# Altium schematic sheet Memory.SchDoc
size A; SheetNumber: 5; SheetTotal: 7
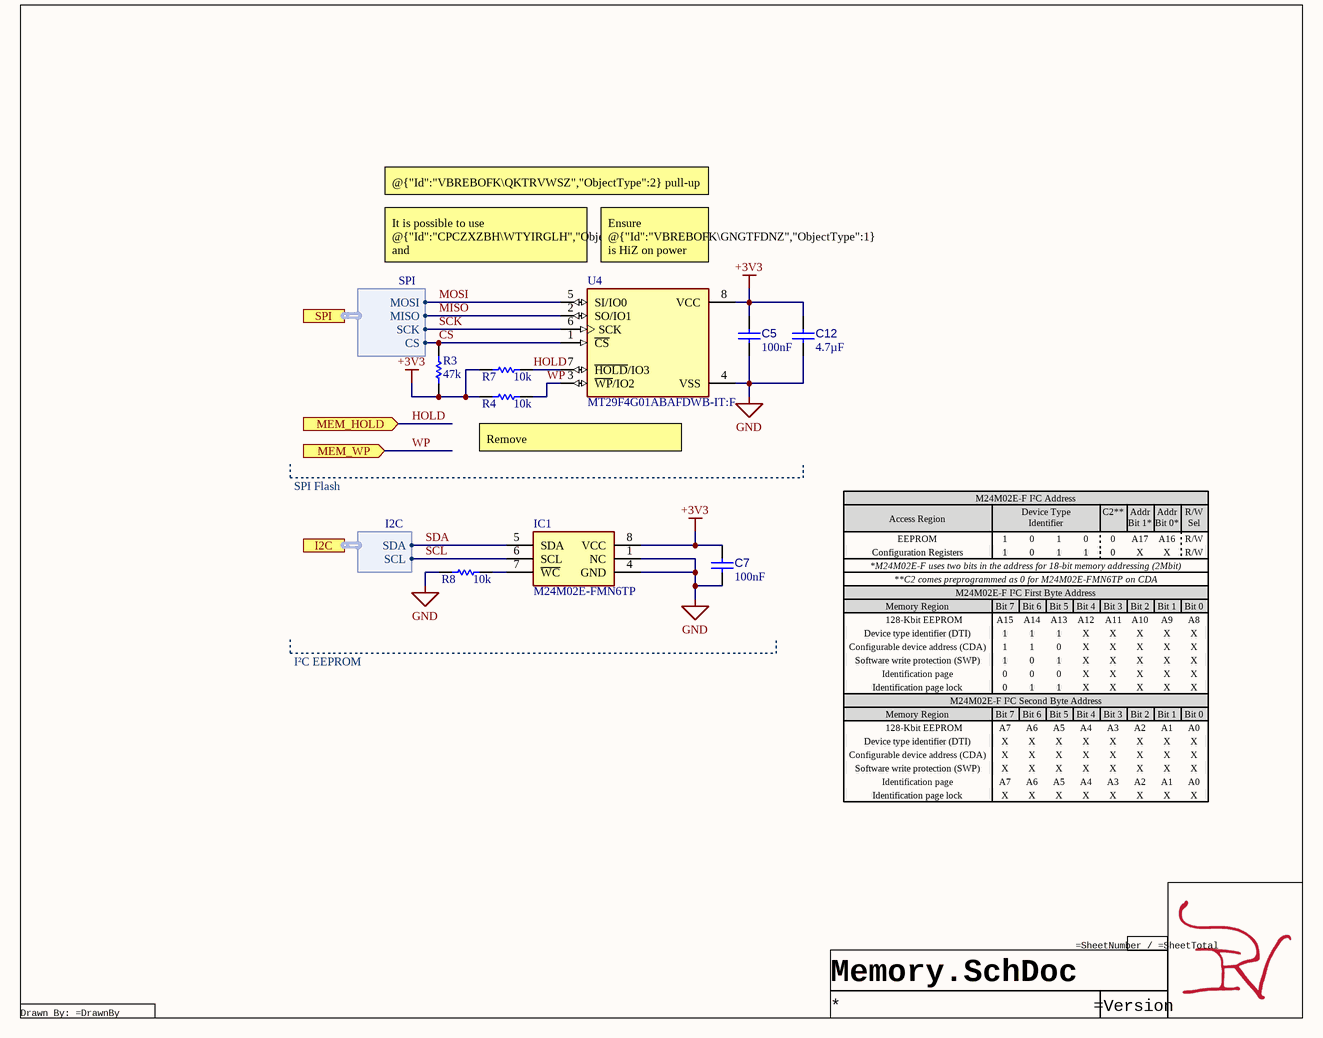
[diagram p0: Memory.SchDoc]

## Parts
C5  value 100nF  [CAP 0402_1005]  (hidden comment: CAP-NP-2)
C7  value 100nF  [CAP 0402_1005]  (hidden comment: CAP-NP-2)
C12  value 4.7µF  [CAP 0402_1005]  (hidden comment: CL05A475MP5NRNC)
IC1  M24M02E-FMN6TP  [SOIC127P600X175-8N]
R3  value 47k  [RES 0402_1005]  (hidden comment: 47k-0402-0.1/1)
R4  value 10k  [RES 0402_1005]  (hidden comment: 10K-0402-0.1/1)
R7  value 10k  [RES 0402_1005]  (hidden comment: 10K-0402-0.1/1)
R8  value 10k  [RES 0402_1005]  (hidden comment: 10K-0402-0.1/1)
U4  MT29F4G01ABAFDWB-IT:F  [FP-WB-IPC_B]

## Ports
I2C (harness I2C), MEM_HOLD (in), MEM_WP (in), SPI (harness SPI)

## Harnesses
SPI: MOSI, MISO, SCK, CS
I2C: SDA, SCL

## Nets
+3V3: C5.2 C7.2 C12.2 IC1.8(VCC) R3.1 R4.1 R7.1 U4.8(VCC)
GND: C5.1 C7.1 C12.1 IC1.1(NC) IC1.4(GND) R8.1 U4.4(VSS)
CS: R3.2 U4.1(~{CS}) ; port SPI.CS
HOLD: R7.2 U4.7(~{HOLD}/IO3) ; port MEM_HOLD
MISO: U4.2(SO/IO1) ; port SPI.MISO
MOSI: U4.5(SI/IO0) ; port SPI.MOSI
SCK: U4.6(SCK) ; port SPI.SCK
SCL: IC1.6(SCL) ; port I2C.SCL
SDA: IC1.5(SDA) ; port I2C.SDA
WP: R4.2 U4.3(~{WP}/IO2) ; port MEM_WP
NetIC1_7: IC1.7(~{WC}) R8.2

## Notes on the sheet
- @{"Id":"VBREBOFK\QKTRVWSZ","ObjectType":2} pull-up can be replaced with a 10k if desired (not tested)
- (near U4) It is possible to use @{"Id":"CPCZXZBH\WTYIRGLH","ObjectType":1} and @{"Id":"CPCZXZBH\EESAOWRM","ObjectType":1} and I/O lines if the Pico uses it's PIO's to make a QSPI line
- (near U4) Ensure @{"Id":"VBREBOFK\GNGTFDNZ","ObjectType":1} is HiZ on power off / brownout
- SPI Flash
- Remove @{"Id":"VBREBOFK\CTDEZDKE","ObjectType":2} and @{"Id":"VBREBOFK\WKPZANBB","ObjectType":2} if using QSPI
- M24M02E-F I²C Address
- Access Region
- EEPROM
- Configuration Registers
- *M24M02E-F uses two bits in the address for 18-bit memory addressing (2Mbit)
- Device Type
  Identifier
- 1
- 0
- C2**
- A17
- X
- Addr Bit 1*
- A16
- Addr Bit 0*
- R/W
  Sel
- R/W
- Memory Region
- M24M02E-F I²C First Byte Address
- Device type identifier (DTI)
- **C2 comes preprogrammed as 0 for M24M02E-FMN6TP on CDA
- 128-Kbit EEPROM
- Bit 7
- A15
- Bit 6
- A14
- Bit 5
- A13
- Bit 4
- A12
- Bit 3
- A11
- Bit 2
- A10
- Bit 1
- A9
- Bit 0
- A8
- I²C EEPROM
- Configurable device address (CDA)
- Software write protection (SWP)
- Identification page
- Identification page lock
- M24M02E-F I²C Second Byte Address
- A7
- A6
- A5
- A4
- A3
- A2
- A1
- A0
- Drawn By: =DrawnBy

## Library data of the parts
C5 C7 = CMP-00000-4: Ceramic Capacitor, Multilayer, Ceramic, 10V, 10% +Tol, 10% -Tol, X7R, 15% TC, 0.1uF, Surface Mount, 0402; Multilayer: Yes; Conflict Mineral: DRC Conflict Undeterminable; Global PFAS Assessment Status: Not Affected; Green: Compliant; NAS411: Affected; Rare Earth Element Information: Rare Earth Free; Capacitor Type: Ceramic; Case/Package: 0402; Dielectric Material: Ceramic; JESD-609 Code: e3; Max Operating Temperature: 125°C; Min Operating Temperature: -55°C; Mounting Technology: Surface Mount; Package Shape: Rectangular; Packaging: Tape and Reel; Pins: 2; Rated DC Voltage (URdc): 10V; Reach SVHC Compliant: Yes; RoHS Compliant: Yes; Temperature Characteristics Code: X7R; Terminal Finish: Nickel; Termination: Wraparound; Tolerance  (fill in as +-): 10%; Tolerance (fill in as +-): 10%; Tolerance: 10%; Voltage Rating: 10V; China RoHS Status: Unaffected; ELV: Compliant; EU SVHC List Version: Jan 23, 2024; Halogen Free: Compliant; Lead Free: Compliant; Persistent Organic Pollutants (POPs): Not Affected; REACH(SVHC) Information: Unaffected; RoHS Status: Yes; RoHS Version: 2011/65/EU, 2015/863; TSCA: Compliant; Capacitance: 100nF; Case Code (Imperial): 0402; Case Code (Metric): 1005; Construction: Flat; Contact Plating: Tin; Depth: 0.5mm; Dielectric: X7R; Height: 0.5mm; Length: 1mm; Mount: Surface Mount; Package Quantity: 1; Package Style: SMTMeter; Radiation Hardening: No; Series: CL; Thickness: 0.022inch; Width: 0.5mm
C12 = CMP-001-00020-1: Ceramic Capacitor, Multilayer, Ceramic, 10V, 20% +Tol, 20% -Tol, X5R, 15% TC, 4.7uF, Surface Mount, 0402; Multilayer: Yes; Terminal Finish: Nickel; JESD-609 Code: e3; Tolerance (fill in as +-): 20%; Case/Package: 0402; Max Operating Temperature: 85°C; Tolerance  (fill in as +-): 20%; Temperature Characteristics Code: X5R; Packaging: Tape and Reel; Mounting Technology: Surface Mount; Width: 0.5mm; Pins: 2; Min Operating Temperature: -55°C; Package Style: SMTMeter; Capacitor Type: Ceramic; RoHS Compliant: Yes; Height: 0.65mm; Rated DC Voltage (URdc): 10V; Termination: Wraparound; Dielectric Material: Ceramic; Reach SVHC Compliant: Yes; Package Shape: Rectangular; Length: 1mm
IC1 = CMP-031-00004-5: 2 Mbit Serial I2C bus EEPROM with configurable device address and software write protection registers; pin to pad: 1>1+2+3; Manufacturer_Name: STMicroelectronics; Mouser Price/Stock: https://www.mouser.co.uk/ProductDetail/STMicroelectronics/M24M02E-FMN6TP?qs=HoCaDK9Nz5fTB3MAjTQXBw%3D%3D; Mouser Part Number: 511-M24M02E-FMN6TP; Design Item ID: M24M02E-FMN6TP; Source: SamacSys.SchLib; Datasheet Link: https://www.st.com/resource/en/datasheet/m24m02e-f.pdf; Height: 1.75mm; Manufacturer_Part_Number: M24M02E-FMN6TP
R3 = CMP-009-00042-1: Fixed Resistor, Metal Glaze/thick Film, 0.1W, 47000ohm, 50V, 1% +/-Tol, 100ppm/Cel, Surface Mount, 0402; Package Width: 0.5mm; Package Length: 1mm; Rated Temperature: 70°C; Power: 100mW; Reference Standard: AEC-Q200; Package Height: 0.35mm; Temperature Coefficient: 100ppm/°C; Tolerance: 1%; Package Shape: Rectangular; Package Style: SMTMeter; Mounting Technology: Surface Mount; JESD-609 Code: e3; Terminal Finish: Nickel; Case/Package: 0402; Packaging: Tape and Reel; Pins: 2; Construction: Rectangular; Termination: Wraparound; RoHS Compliant: Yes; Technology: METAL GLAZE/THICK FILM; Resistor Type: FIXED RESISTOR; Working Voltage: 50V; Max Operating Temperature: 155°C; Reach SVHC Compliant: Yes; Min Operating Temperature: -55°C
R4 R7 R8 = CMP-009-00033-2: Fixed Resistor, Metal Glaze/thick Film, 0.1W, 10000ohm, 50V, 1% +/-Tol, 100ppm/Cel, Surface Mount, 0402; Power: 100mW; Conflict Mineral: DRC Conflict Undeterminable; Global PFAS Assessment Status: Not Affected; Green: Not Compliant; NAS411: Affected; Package Height: 0.35mm; Package Length: 1mm; Package Width: 0.5mm; Persistent Organic Pollutants (POPs): Compliant; Rare Earth Element Information: Rare Earth Free; Rated Temperature: 70°C; Reference Standard: AEC-Q200; Temperature Coefficient: 100ppm/°C; Tolerance: 1%; Mounting Technology: Surface Mount; Min Operating Temperature: -55°C; Max Operating Temperature: 155°C; Pins: 2; RoHS Compliant: Yes; Case/Package: 0402; China RoHS Status: Affected; Construction: Rectangular; ELV: Not Compliant; EU SVHC List Version: Jan 23, 2024; Halogen Free: Compliant; JESD-609 Code: e3; Lead Free: Not Compliant; Package Shape: Rectangular; Package Style: SMTMeter; Packaging: Tape and Reel; REACH(SVHC) Information: Unaffected; Reach SVHC Compliant: Yes; Resistor Type: FIXED RESISTOR; RoHS Status: Yes with Exemption; RoHS Version: 2011/65/EU, 2015/863; Technology: METAL GLAZE/THICK FILM; Terminal Finish: Nickel; Termination: Wraparound; TSCA: Compliant; Working Voltage: 50V
U4 = CMP-019-00004-2: SLC NAND Flash Serial-SPI 3.3V 4Gbit 4G X 1bit 5ns/6ns 8-Pin UPDFN Tray